# Altium schematic sheet PowerMeter_PowerSupply.SchDoc: Power Meter - Power Supply
size A4; Date: 10/02/2022; Author: SFARA, Gonzalo Agustín; CompanyName: Introducción al Diseño de Circuitos Impresos; Organization: UTN FRBA; Revision: 02; SheetNumber: 2; SheetTotal: 5
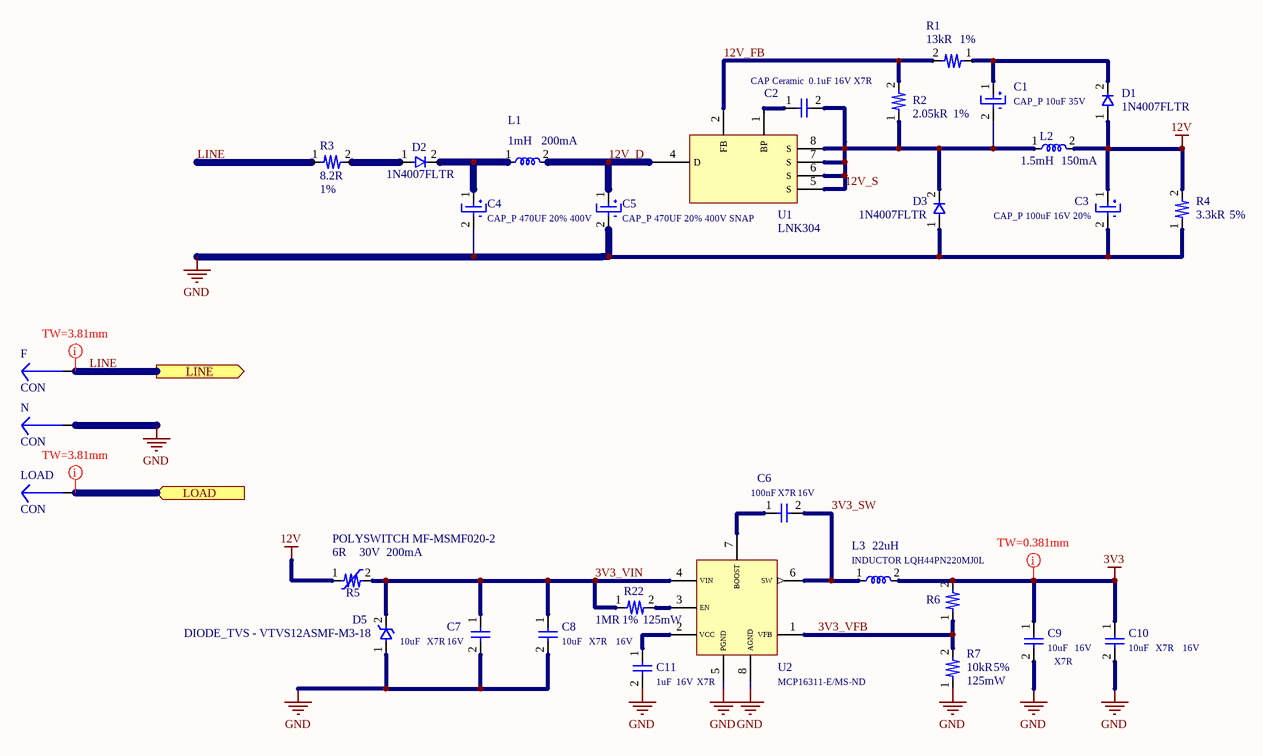
[diagram p0: PowerMeter_PowerSupply.SchDoc]

## Parts
C1  CAP_P 10uF 35V  [CAP100RP]
C2  CAP Ceramic  0.1uF 16V X7R  [C_0805]
C3  CAP_P 100uF 16V 20%  [CAP100RP]
C4  CAP_P 470UF 20% 400V  [CAP400RP]
C5  CAP_P 470UF 20% 400V SNAP  [CAP400RP]
C6  Capacitance: 100nF  Voltage Rating (DC): 16V  Dielectric: X7R  [C_0805]  (hidden comment: CAP Ceramic  0.1uF 16V X7R)
C7  Capacitance: 10uF  Dielectric: X7R  Voltage Rating: 16V  [C_1206]  (hidden comment: CAP Ceramic  10uF 16V X7R)
C8  Capacitance: 10uF  Dielectric: X7R  Voltage Rating: 16V  [C_1206]  (hidden comment: CAP Ceramic  10uF 16V X7R)
C9  Capacitance: 10uF  Dielectric: X7R  Voltage Rating: 16V  [C_1206]  (hidden comment: CAP Ceramic 10uF 16V X7R)
C10  Capacitance: 10uF  Dielectric: X7R  Voltage Rating: 16V  [C_1206]  (hidden comment: CAP Ceramic 10uF 16V X7R)
C11  Capacitance: 1uF  Dielectric: X7R  Voltage Rating: 16V  [C_0805]  (hidden comment: CAP Ceramic  1uF 16V X7R)
D1  Manufacturer Part Number: 1N4007FLTR  [SOD_123]  (hidden comment: DIODE)
D2  Manufacturer Part Number: 1N4007FLTR  [SOD_123]  (hidden comment: Standard Rectifier 1000V SOD-123)
D3  Manufacturer Part Number: 1N4007FLTR  [SOD_123]  (hidden comment: DIODE 1N4007FLTR)
D5  DIODE_TVS - VTVS12ASMF-M3-18  [SOD_923]
F  CON  [HOLE 2.8]  (no BOM)
L1  Current Rating: 200mA  Inductance: 1mH  [LQH44]  (hidden comment: INDUCTOR RLH0912-102KL)
L2  Inductance: 1.5mH  Current Rating: 150mA  [LQH44]  (hidden comment: INDUCTOR AIUR-16-152K)
L3  INDUCTOR LQH44PN220MJ0L  Inductance: 22uH  [LQH44]
LOAD  CON  [HOLE 2.8]  (no BOM)
N  CON  [HOLE 2.8]  (no BOM)
R1  Resistance: 13kR  Tolerance: 1%  [R_0805]  (hidden comment: RES 13K Ohm 1% 1/8W)
R2  Resistance: 2.05kR  Tolerance: 1%  [R_0805]  (hidden comment: RES 2.05K Ohm 1% 1/8W)
R3  Resistance: 8.2R  Tolerance: 1%  [R_0805]  (hidden comment: RES 0805 8.2 Ohm 1W)
R4  Tolerance: 5%  Resistance: 3.3kR  [R_0805]  (hidden comment: RES  3.3 K Ohms 0.125W; +/-5%)
R5  POLYSWITCH MF-MSMF020-2  Resistance: 6R  Hold Current: 200mA  Voltage Rating (DC): 30V  [NANOSMDC]
R6  RES 31.2K Ohm 1% 1/8W  [R_0805]  (value not drawn)
R7  Resistance: 10kR  Tolerance: 5%  Power Rating: 125mW  [R_0805]  (hidden comment: RES 10K Ohm 1% 1/8W)
R22  Resistance: 1MR  Power Rating: 125mW  Tolerance: 1%  [R_0805]  (hidden comment: RES 1M Ohm 1% 1/8W)
U1  LNK304  [LNK304]
U2  Supplier Part Number 1: MCP16311-E/MS-ND  [MCP16311/2]  (hidden comment: STEP-DOWN REGULATOR MCP16311-E/MS-ND)

## Ports
LINE (out), LOAD (in)

## Nets
3V3: C9.1 C10.1 L3.2 R6.2
12V: C3.1 D1.1 L2.2 R4.2 R5.1
GND: C3.2 C4.2 C5.2 C7.2 C8.2 C9.2 C10.2 C11.2 D3.1 D5.1 N.1 R4.1 R7.1 U2.5(PGND) U2.8(AGND)
3V3_SW: C6.2 L3.1 U2.6(SW)
3V3_VFB: R6.1 R7.2 U2.1(VFB)
3V3_VIN: C7.1 C8.1 D5.2 R5.2 R22.1 U2.4(VIN)
12V_D: C5.1 L1.2 U1.4(D)
12V_FB: R1.2 R2.2 U1.2(FB)
12V_S: C1.2 C2.2 D3.2 L2.1 R2.1 U1.5(S) U1.6(S) U1.7(S) U1.8(S)
LINE: F.1 R3.1 ; port LINE
LOAD: LOAD.1 ; port LOAD
NetC1_1: C1.1 D1.2 R1.1
NetC2_1: C2.1 U1.1(BP)
NetC4_1: C4.1 D2.2 L1.1
NetC6_1: C6.1 U2.7(BOOST)
NetC11_1: C11.1 U2.2(VCC)
NetD2_1: D2.1 R3.2
NetR22_2: R22.2 U2.3(EN)

## Layout directives
rule Width Constraint [Pref Width = 150mil    Min Width = 70mil    Max Width = 180mil]: LINE, LOAD
rule Width Constraint [Pref Width = 18mil    Min Width = 15mil    Max Width = 20mil]: 3V3

## Notes on the sheet
- Title:
- Size:
- Author:
- A4
- Sheet
- of
- Revision:
- File:
- Date:

## Library data of the parts
C1 = CAP_P: Cap Aluminum 10uF 35V 20% Radial 2000 hr 85°C Ammo Pack; Manufacturer: Panasonic; Manufacturer Part Number: ECA-1VM100B; Ripple Current: 60mA; Life (Hours): 2000Hour; Lead/Base Style: Straight; Polarity: Polar; Supplier 1: Mouser; Supplier Part Number 1: 667-ECA-1VM100B; RoHS: Yes; Category: Aluminum Electrolytic Capacitors; Stock 1: 1014; Pricing 1: 1=0,24000, 10=0,16100, 50=0,16100, 100=0,08200, 500=0,05600, 1000=0,05000, 10000=0,04700 (USD); Mount: Through Hole; Case/Package: Radial; Min Operating Temperature: -40°C; Max Operating Temperature: 85°C; Capacitance: 10uF; Voltage Rating: 35V; Tolerance: 20%; Packaging: Ammo Pack; Package Quantity: 2000; Voltage Rating (DC): 35V; Termination: Radial; Series: M; Length: 11mm; Lead Pitch: 0.197inch; Height - Seated (Max): 0.472inch; RoHS Compliant: Yes; ComponentLink1URL: https://datasheet.ciiva.com/105/eca-xxmspec-105829.pdf?src-supplier=Digi-Key; ComponentLink1Description: https://datasheet.ciiva.com/105/eca-xxmspec-105829.pdf?src-supplier=Digi-Key; ComponentLink2URL: https://datasheet.ciiva.com/24035/aba0000ce12-465472-24035802.pdf?src-supplier=Mouser; ComponentLink2Description: https://datasheet.ciiva.com/24035/aba0000ce12-465472-24035802.pdf?src-supplier=Mouser
C2 = CAP_NP: Cap Ceramic 0.1uF 16V X7R 10% SMD 0805 125C Paper T/R; Manufacturer: Yageo; Manufacturer Part Number: CC0805KPX7R7BB104; Capacitance: 100nF; Supplier 1: Digi-Key; Supplier Part Number 1: 13-CC0805KPX7R7BB104TR-ND; RoHS: Yes; Category: Ceramic Capacitors; Pricing 1: 60000=0,01497 (USD); Case/Package: 0805; Case Code (Imperial): 0805; Case Code (Metric): 2012; Weight: 0.000194oz; Min Operating Temperature: -55°C; Max Operating Temperature: 125°C; Tolerance: 10%; Packaging: Tape and Reel; Voltage Rating (DC): 16V; Dielectric: X7R; Termination: SMD/SMT; Resistor Type: Ceramic; Lead Free: Lead Free; Halogen Free: Halogen Free; RoHS Compliant: Yes; ComponentLink1URL: https://datasheet.ciiva.com/13265/upy-gphc-x7r-6-3v-to-50v-8-12304-13265229.pdf?src-supplier=Mouser; ComponentLink1Description: https://datasheet.ciiva.com/13265/upy-gphc-x7r-6-3v-to-50v-8-12304-13265229.pdf?src-supplier=Mouser
C3 = CAP_P: Cap Aluminum 100uF 16V 20% (5 X 11mm) Radial 2.5mm 180mA 2000h 85°C Ammo Pack; Manufacturer: Panasonic; Manufacturer Part Number: ECA-1CM101I; Life (Hours): 2000Hour; Leakage Current: 3mA; Dissipation Factor: 0.2%; Lead/Base Style: Straight; Lead Diameter: 0.5mm; ComponentLink6URL: https://datasheet.ciiva.com/15197/getdatasheetpartid-408579-15197882.pdf?src-supplier=Verical; ComponentLink6Description: https://datasheet.ciiva.com/15197/getdatasheetpartid-408579-15197882.pdf?src-supplier=Verical; ComponentLink7URL: https://datasheet.ciiva.com/7803/1907780-7803673.pdf?src-supplier=Element14; ComponentLink7Description: https://datasheet.ciiva.com/7803/1907780-7803673.pdf?src-supplier=Element14; ComponentLink8URL: https://datasheet.ciiva.com/14604/70067785-14604665.pdf?src-supplier=Allied+Electronics; ComponentLink8Description: https://datasheet.ciiva.com/14604/70067785-14604665.pdf?src-supplier=Allied+Electronics; ComponentLink9URL: https://datasheet.ciiva.com/17530/aba0000ce12-17530237.pdf?src-supplier=Avnet+Europe; ComponentLink9Description: https://datasheet.ciiva.com/17530/aba0000ce12-17530237.pdf?src-supplier=Avnet+Europe; Supplier 1: Digi-Key; Supplier Part Number 1: P10408TB-ND; RoHS: Yes; Category: Aluminum Electrolytic Capacitors; Stock 1: 8000; Pricing 1: 2000=0,05364 (USD); Mount: Through Hole,PCB; Case/Package: Radial; Contact Plating: Tin; Min Operating Temperature: -40°C; Max Operating Temperature: 85°C; Tolerance: 20%; Capacitance: 100uF; Ripple Current: 180mA; Voltage Rating: 16V; Voltage Rating (DC): 16V; Package Quantity: 2000; Packaging: Ammo Pack; Termination: Radial; Voltage: 16V; Series: M; Construction: RADIAL; Diameter: 5mm; Length: 11mm; Height: 11mm; Lead Pitch: 2.5mm; Height - Seated (Max): 0.472inch; Radiation Hardening: No; REACH SVHC: Unknown; Lead Free: Lead Free; RoHS Compliant: Yes; ComponentLink1URL: https://datasheet.ciiva.com/6134/aba0000ce12-6134415.pdf?src-supplier=Farnell; ComponentLink1Description: https://datasheet.ciiva.com/6134/aba0000ce12-6134415.pdf?src-supplier=Farnell; ComponentLink2URL: https://datasheet.ciiva.com/24026/aba0000ce12-465472-24026826.pdf?src-supplier=Mouser; ComponentLink2Description: https://datasheet.ciiva.com/24026/aba0000ce12-465472-24026826.pdf?src-supplier=Mouser; ComponentLink3URL: https://datasheet.ciiva.com/11680/aba0000ce12-11680309.pdf?src-supplier=Avnet; ComponentLink3Description: https://datasheet.ciiva.com/11680/aba0000ce12-11680309.pdf?src-supplier=Avnet; ComponentLink4URL: https://datasheet.ciiva.com/16202/aba0000ce12-16202587.pdf?src-supplier=Future+Electronics; ComponentLink4Description: https://datasheet.ciiva.com/16202/aba0000ce12-16202587.pdf?src-supplier=Future+Electronics; ComponentLink5URL: https://datasheet.ciiva.com/15197/getdatasheetpartid-408579-15197882.pdf?src-supplier=Verical; ComponentLink5Description: https://datasheet.ciiva.com/15197/getdatasheetpartid-408579-15197882.pdf?src-supplier=Verical
C4 = CAP_P: CAP ALUM 470UF 20% 400V SNAP; Manufacturer: Rubycon; Manufacturer Part Number: 400USG470MEFC25X50; Polarity: Polar; Life (Hours): 3000Hour; Supplier 1: Digi-Key; Supplier Part Number 1: 400USG470MEFC25X50-ND; RoHS: Yes; Category: Aluminum Electrolytic Capacitors; Pricing 1: 200=2,69535 (USD); Mount: Through Hole; Case/Package: Radial; Min Operating Temperature: -25°C; Max Operating Temperature: 85°C; Packaging: Bulk; Capacitance: 470uF; Tolerance: 20%; Voltage Rating: 400V; ComponentLink1URL: http://www.rubycon.co.jp/en/catalog/e_pdfs/aluminum/e_USG.pdf?src-supplier=Digi-Key; ComponentLink1Description: http://www.rubycon.co.jp/en/catalog/e_pdfs/aluminum/e_USG.pdf?src-supplier=Digi-Key
C5 = CAP_P: CAP ALUM 470UF 20% 400V; Manufacturer: Rubycon; Manufacturer Part Number: 400USG470MEFC25X50; Polarity: Polar; Life (Hours): 3000Hour; Supplier 1: Digi-Key; Supplier Part Number 1: 400USG470MEFC25X50-ND; RoHS: Yes; Category: Aluminum Electrolytic Capacitors; Pricing 1: 200=2,69535 (USD); Mount: Through Hole; Case/Package: Radial; Min Operating Temperature: -25°C; Max Operating Temperature: 85°C; Packaging: Bulk; Capacitance: 470uF; Tolerance: 20%; Voltage Rating: 400V; ComponentLink1URL: http://www.rubycon.co.jp/en/catalog/e_pdfs/aluminum/e_USG.pdf?src-supplier=Digi-Key; ComponentLink1Description: http://www.rubycon.co.jp/en/catalog/e_pdfs/aluminum/e_USG.pdf?src-supplier=Digi-Key
C6 = CAP_NP: Cap Ceramic 0.1uF 16V X7R 10% SMD 0805 125C Paper T/R; Manufacturer: Yageo; Manufacturer Part Number: CC0805KPX7R7BB104; Supplier 1: Digi-Key; Supplier Part Number 1: 13-CC0805KPX7R7BB104TR-ND; RoHS: Yes; Category: Ceramic Capacitors; Pricing 1: 60000=0,01497 (USD); Case/Package: 0805; Case Code (Imperial): 0805; Case Code (Metric): 2012; Weight: 0.000194oz; Min Operating Temperature: -55°C; Max Operating Temperature: 125°C; Tolerance: 10%; Packaging: Tape and Reel; Termination: SMD/SMT; Resistor Type: Ceramic; Lead Free: Lead Free; Halogen Free: Halogen Free; RoHS Compliant: Yes; ComponentLink1URL: https://datasheet.ciiva.com/13265/upy-gphc-x7r-6-3v-to-50v-8-12304-13265229.pdf?src-supplier=Mouser; ComponentLink1Description: https://datasheet.ciiva.com/13265/upy-gphc-x7r-6-3v-to-50v-8-12304-13265229.pdf?src-supplier=Mouser
C7-C10 = CAP_NP: CL31 Series 1206 10 uF 16 V ±10% Tolerance X7R Multilayer Ceramic Capacitor; Manufacturer: Samsung; Manufacturer Part Number: CL31B106KOHNNNF; Supplier 1: Future Electronics; Supplier Part Number 1: 5039552; RoHS: Yes; Category: Ceramic Capacitors; Stock 1: 2000; Pricing 1: 8000=0,04240, 16000=0,03440, 24000=0,03410, 32000=0,03390 (USD); Mount: Surface Mount; Case/Package: 1206; Min Operating Temperature: -55°C; Max Operating Temperature: 125°C; Tolerance: 10%; Packaging: Tape and Reel; Package Quantity: 8000; Voltage Rating (DC): 16V; Series: CL; Construction: Flat; Length: 3.2mm; Width: 0.063inch; Height: 1.6mm; Thickness: 0.071inch; Depth: 1.6mm; Radiation Hardening: No; Lead Free: Lead Free; RoHS Compliant: Yes; ComponentLink1URL: https://datasheet.ciiva.com/25728/cl31b106kohnnnf-25728936.pdf?src-supplier=Digi-Key; ComponentLink1Description: https://datasheet.ciiva.com/25728/cl31b106kohnnnf-25728936.pdf?src-supplier=Digi-Key
  C7 C9 C10: Value: *
C11 = CAP_NP: Cap Ceramic 1uF 16V X7R 10% Pad SMD 0805 125C T/R; Manufacturer: Samsung; Manufacturer Part Number: CL21B105KOFNNNF; Supplier 1: RSComponents; Supplier Part Number 1: 7665607; RoHS: Yes; Category: Ceramic Capacitors; Stock 1: 10000; Pricing 1: 10000=0,01200, 30000=0,01200, 50000=0,01100, 100000=0,01100, 250000=0,01000, 10000=0,00900, 30000=0,00900, 50000=0,00800, 100000=0,00800, 250000=0,00700 (USD); Mount: Surface Mount; Case/Package: 0805; Material: Ceramic; Min Operating Temperature: -55°C; Max Operating Temperature: 125°C; Tolerance: 10%; Packaging: Tape and Reel; Package Quantity: 10000; Voltage: 16V; Voltage Rating (DC): 16V; Series: CL; Construction: Flat; Length: 2mm; Width: 0.049inch; Height: 1.25mm; Thickness: 0.053inch; Depth: 1.25mm; Radiation Hardening: No; Lead Free: Lead Free; ComponentLink1URL: https://datasheet.ciiva.com/15195/getdatasheetpartid-359322-15195881.pdf?src-supplier=Verical; ComponentLink1Description: https://datasheet.ciiva.com/15195/getdatasheetpartid-359322-15195881.pdf?src-supplier=Verical; ComponentLink2URL: https://datasheet.ciiva.com/29199/455923-da-01-en-vs-kondensator-0805-29199045.pdf?src-supplier=Conrad; ComponentLink2Description: https://datasheet.ciiva.com/29199/455923-da-01-en-vs-kondensator-0805-29199045.pdf?src-supplier=Conrad; ComponentLink3URL: https://datasheet.ciiva.com/16290/cl05b104kq5nnnc-16290394.pdf?src-supplier=Future+Electronics; ComponentLink3Description: https://datasheet.ciiva.com/16290/cl05b104kq5nnnc-16290394.pdf?src-supplier=Future+Electronics; ComponentLink4URL: https://datasheet.ciiva.com/26310/mlcc-catalogdownload2013-eng-26310168.pdf?src-supplier=Distrelec; ComponentLink4Description: https://datasheet.ciiva.com/26310/mlcc-catalogdownload2013-eng-26310168.pdf?src-supplier=Distrelec
D1 D3 = DIODE: Standard Rectifier 1000V SOD-123; Manufacturer: Sangdest Microelectronics; Supplier 1: Digi-Key; Supplier Part Number 1: 1655-1N4007FLCT-ND; RoHS: No; Stock 1: 1344; Pricing 1: 1=0,15000, 10=0,13400, 100=0,07310, 500=0,04502, 1000=0,03069 (USD)
D2 = DIODE: Manufacturer: Sangdest Microelectronics; Supplier 1: Digi-Key; Supplier Part Number 1: 1655-1N4007FLCT-ND; RoHS: No; Description: Standard Rectifier 1000V SOD-123; Stock 1: 1934; Pricing 1: 1=0,15000, 10=0,13400, 100=0,07310, 500=0,04502, 1000=0,03069 (USD)
D5 = DIODE_TVS: Esd Protection Diode Smf Do219Ab5%; 12.4V; ir0.05 A; ip19.5A; p400W; cd807Pf; Manufacturer: Vishay; Supplier 1: Digi-Key; Supplier Part Number 1: VTVS12ASMF-M3-18-ND; Manufacturer Part Number: VTVS12ASMF-M3-18; RoHS: Yes; Category: TVS Diodes; Pricing 1: 50000=0,10890 (USD); RoHS Compliant: Yes
F LOAD N = CON: Hole
L1 = INDUCTOR: Magnetics - Fixed Inductor Through Hole / Bulk, Bag Packaging Rohs Compliant: Yes; Manufacturer: Bourns; Core Material: Ferrite; Self Resonant Frequency: 1.9MHz; Tolerance: 10%; Shielding: Unshielded; DC Resistance (DCR): 4.3R; Test Frequency: 1kHz; Max DC Current: 510mA; Q Factor: 20; Supplier 1: Mouser; Supplier Part Number 1: 652-RLH0912-102KL; Manufacturer Part Number: RLH0912-102KL; RoHS: Yes; Category: Fixed Inductors; Stock 1: 664; Pricing 1: 1=0,67000, 10=0,49900, 50=0,49900, 100=0,41900, 1000=0,28400, 10000=0,25900 (USD); Mount: Through Hole; Case/Package: Radial; Min Operating Temperature: -40°C; Max Operating Temperature: 105°C; Package Quantity: 1000; Packaging: Bulk; Resistor Type: Wirewound; Termination: Radial; Series: RLB; Height - Seated (Max): 0.512inch; ComponentLink1URL: http://www.mouser.com/ds/2/54/lb9012-778371.pdf?src-supplier=Mouser; ComponentLink1Description: http://www.mouser.com/ds/2/54/lb9012-778371.pdf?src-supplier=Mouser; ComponentLink2URL: http://www.bourns.com/docs/Product-Datasheets/rlb.pdf?src-supplier=Digi-Key; ComponentLink2Description: http://www.bourns.com/docs/Product-Datasheets/rlb.pdf?src-supplier=Digi-Key
L2 = INDUCTOR: Inductor Power Unshielded Drum Core 1500uH 10% 10KHz Ferrite 0.15A 3.5Ohm DCR RDL Box; Manufacturer: Abracon; Saturation Current: 135mA; DC Resistance (DCR): 3.5R; Supplier 1: Digi-Key; Supplier Part Number 1: AIUR-16-152K-ND; Manufacturer Part Number: AIUR-16-152K; RoHS: Yes; Category: Fixed Inductors; Stock 1: 1719; Pricing 1: 1=0,75000, 10=0,65500, 25=0,60840, 50=0,51480, 100=0,46800, 250=0,43992, 500=0,39312, 1000=0,31824, 2500=0,29952 (USD); Mount: Through Hole; Case/Package: Radial; Core Material: Ferrite; Min Operating Temperature: -25°C; Max Operating Temperature: 85°C; Packaging: Bulk; Resistor Type: Wirewound; Shielding: Unshielded; Test Frequency: 10kHz; Tolerance: 10%; Height - Seated (Max): 0.374inch; ComponentLink1URL: http://www.abracon.com/Magnetics/radial/AIUR15-16.pdf?src-supplier=Digi-Key; ComponentLink1Description: http://www.abracon.com/Magnetics/radial/AIUR15-16.pdf?src-supplier=Digi-Key
L3 = INDUCTOR: Inductor Power Chip Shielded Wirewound 22uH 20% 100KHz Ferrite 0.55A 0.576Ohm DCR 1515 T/R; Manufacturer: Murata; Self Resonant Frequency: 18MHz; Shielding: Unshielded; Current Rating: 550mA; DC Resistance (DCR): 576mR; Saturation Current: 400mA; Supplier 1: Digi-Key; Supplier Part Number 1: 490-7775-1-ND; Manufacturer Part Number: LQH44PN220MJ0L; RoHS: Yes; Category: Fixed Inductors; Stock 1: 1622; Pricing 1: 1=0,47000, 10=0,41400, 25=0,36280, 50=0,31080, 100=0,28500, 250=0,25904, 500=0,24350 (USD); Mount: Surface Mount; Case/Package: 1515; Core Material: Ferrite; Weight: 0.002469oz; Min Operating Temperature: -40°C; Max Operating Temperature: 125°C; Tolerance: 20%; Packaging: Tape and Reel; Inductance Tolerance: 20%; Package Quantity: 1000; Max DC Current: 550mA; Termination: SMD/SMT; Resistor Type: Wirewound; Test Frequency: 100kHz; DC Current: 550mA; Series: LQH44P; Length: 4mm; Width: 4mm; Height: 0.9mm; Height - Seated (Max): 0.047inch; Depth: 4.2mm; REACH SVHC: No SVHC; Military Standard: Not; Lead Free: Lead Free; RoHS Compliant: Yes; ComponentLink1URL: https://datasheet.ciiva.com/8506/l0075s0103lqh44p-j0-8506832.pdf?src-supplier=Avnet; ComponentLink1Description: https://datasheet.ciiva.com/8506/l0075s0103lqh44p-j0-8506832.pdf?src-supplier=Avnet; ComponentLink2URL: https://datasheet.ciiva.com/3867/250lqh44pn220mj023-3867187.pdf?src-supplier=Arrow+Electronics; ComponentLink2Description: https://datasheet.ciiva.com/3867/250lqh44pn220mj023-3867187.pdf?src-supplier=Arrow+Electronics; ComponentLink3URL: https://datasheet.ciiva.com/30489/0900766b81256153-30489173.pdf?src-supplier=RSComponents; ComponentLink3Description: https://datasheet.ciiva.com/30489/0900766b81256153-30489173.pdf?src-supplier=RSComponents; ComponentLink4URL: https://datasheet.ciiva.com/29696/product-29696602.pdf?src-supplier=Digi-Key; ComponentLink4Description: https://datasheet.ciiva.com/29696/product-29696602.pdf?src-supplier=Digi-Key; ComponentLink5URL: https://datasheet.ciiva.com/29696/product-29696603.pdf?src-supplier=Digi-Key; ComponentLink5Description: https://datasheet.ciiva.com/29696/product-29696603.pdf?src-supplier=Digi-Key; ComponentLink6URL: https://datasheet.ciiva.com/29696/product-29696604.pdf?src-supplier=Digi-Key; ComponentLink6Description: https://datasheet.ciiva.com/29696/product-29696604.pdf?src-supplier=Digi-Key
R1 = RES: Res Thick Film 0805 13K Ohm 1% 1/8W ±100ppm/°C Molded SMD SMD Paper T/R; Manufacturer: Stackpole Electronics; Manufacturer Part Number: RMCF0805FG13K0; Max Power Dissipation: 125mW; Supplier 1: Digi-Key; Supplier Part Number 1: RMCF0805FG13K0-ND; RoHS: Yes; Category: Chip SMD Resistors; Pricing 1: 10000=0,00304 (USD); Mount: Surface Mount; Case/Package: 0805; Contact Plating: Tin,Matte; Min Operating Temperature: -55°C; Max Operating Temperature: 155°C; Packaging: Tape and Reel; Resistor Type: Thick Film; Number of Terminations: 2; Temperature Coefficient: 100ppm/°C; Features: Automotive AEC-Q200; Series: RMCF; Length: 0.079inch; Width: 0.049inch; Height: 0.026inch; Radiation Hardening: No; RoHS Compliant: Yes; ComponentLink1URL: https://www.seielect.com/Catalog/SEI-RMCF_RMCP.pdf?src-supplier=Digi-Key; ComponentLink1Description: https://www.seielect.com/Catalog/SEI-RMCF_RMCP.pdf?src-supplier=Digi-Key; ComponentLink2URL: https://www.seielect.com/catalog/SEI-RMCF_RMCP.pdf?src-supplier=Avnet; ComponentLink2Description: https://www.seielect.com/catalog/SEI-RMCF_RMCP.pdf?src-supplier=Avnet
R2 = RES: Res Thick Film 0805 2.05K Ohm 1% 1/8W ±200ppm/°C Molded SMD SMD Paper T/R; Manufacturer: Stackpole Electronics; Manufacturer Part Number: RMCF0805FG2K05; Temperature Coefficient: 100ppm/°C; Max Power Dissipation: 125mW; Supplier 1: Digi-Key; Supplier Part Number 1: RMCF0805FG2K05-ND; RoHS: Yes; Category: Chip SMD Resistors; Pricing 1: 10000=0,00304 (USD); Mount: Surface Mount; Case/Package: 0805; Min Operating Temperature: -55°C; Max Operating Temperature: 155°C; Packaging: Tape and Reel; Resistor Type: Thick Film; Features: Automotive AEC-Q200; Series: RMCF; Number of Terminations: 2; Radiation Hardening: No; ComponentLink1URL: https://www.seielect.com/catalog/SEI-RMCF_RMCP.pdf?src-supplier=Avnet; ComponentLink1Description: https://www.seielect.com/catalog/SEI-RMCF_RMCP.pdf?src-supplier=Avnet; ComponentLink2URL: https://www.seielect.com/catalog/sei-rmcf_rmcp.pdf?src-supplier=Digi-Key; ComponentLink2Description: https://www.seielect.com/catalog/sei-rmcf_rmcp.pdf?src-supplier=Digi-Key
R3 = RES: Res Thin Film 0805 8.2 Ohm 1% 1W ±100ppm/C Pad SMD T/R; Manufacturer: Vishay Dale Thin Film; Manufacturer Part Number: PCAN0805K8R20FST5; Temperature Coefficient: 100ppm/°C; Supplier 1: Digi-Key; Supplier Part Number 1: 764-1235-1-ND; RoHS: Yes; Category: Chip SMD Resistors; Stock 1: 80; Pricing 1: 1=1,36000, 10=1,20400, 100=0,87410 (USD); Case/Package: 0805; Case Code (Metric): 2012; Case Code (Imperial): 0805; Min Operating Temperature: -55°C; Max Operating Temperature: 155°C; Packaging: Tape and Reel; Resistor Type: Thin Film; Number of Terminations: 2; Max Power Dissipation: 1W; Features: Moisture Resistant; Length: 0.08inch; Width: 0.05inch; Height: 0.018inch; RoHS Compliant: Yes; ComponentLink1URL: http://www.vishay.com/docs/60125/pcan.pdf?src-supplier=Digi-Key; ComponentLink1Description: http://www.vishay.com/docs/60125/pcan.pdf?src-supplier=Digi-Key; ComponentLink2URL: http://www.vishay.com/docs/49563/_pcan_vmn-pt0416.pdf?src-supplier=Digi-Key; ComponentLink2Description: http://www.vishay.com/docs/49563/_pcan_vmn-pt0416.pdf?src-supplier=Digi-Key
R4 = RES: Resistor, Thick Film Chip; 3.3 K Ohms; Case 0805; 0.125W; +/-5%; SMD; 200ppm/K; 150V; Manufacturer: Vishay Dale; Manufacturer Part Number: CRCW08053K30JNTA; Temperature Coefficient: 200ppm/°C; Power Rating: 125mW; Supplier 1: Arrow Electronics; Supplier Part Number 1: CRCW08053K30JNTA; RoHS: No; Category: Chip SMD Resistors; Stock 1: 827; Pricing 1: 1=0,11090, 10=0,09470, 25=0,09380, 100=0,04100, 250=0,03880, 500=0,03830 (USD); Case/Package: 0805; Case Code (Metric): 2012; Case Code (Imperial): 0805; Contact Plating: Tin,Lead; Weight: 0.000194oz; Min Operating Temperature: -55°C; Max Operating Temperature: 155°C; Packaging: Tape and Reel; Resistor Type: Thick Film; Series: CRCW; Construction: Rectangular; Number of Terminations: 2; Max Power Dissipation: 125mW; Voltage Rating (DC): 150V; Features: Automotive AEC-Q200; Voltage Rating: 150V; Package Quantity: 5000; Power Dissipation: 125mW; Length: 2mm; Width: 0.049inch; Height: 0.02inch; Depth: 1.25mm; Radiation Hardening: No; Military Standard: Not; Lead Free: Contains Lead; RoHS Compliant: No; ComponentLink1URL: https://datasheet.ciiva.com/2565/dcrcw-2565787.pdf?src-supplier=Digi-Key; ComponentLink1Description: https://datasheet.ciiva.com/2565/dcrcw-2565787.pdf?src-supplier=Digi-Key; ComponentLink2URL: https://datasheet.ciiva.com/9080/dcrcw-9080603.pdf?src-supplier=Avnet; ComponentLink2Description: https://datasheet.ciiva.com/9080/dcrcw-9080603.pdf?src-supplier=Avnet; ComponentLink3URL: https://datasheet.ciiva.com/15159/getdatasheetpartid-79319-15159830.pdf?src-supplier=Verical; ComponentLink3Description: https://datasheet.ciiva.com/15159/getdatasheetpartid-79319-15159830.pdf?src-supplier=Verical
R5 = POLYSWITCH: PTC Resettable Fuse 0.2A(hold) 0.4A(trip) 30V 80A 0.8W 0.06s 0.4Ohm SMD Solder Pad 1812 T/R Automotive; Manufacturer: Bourns; Number of Terminals/Pins: 2; Power Dissipation: 800mW; Tolerance: 5%; Trip Current: 400mA; Aging: 1000 hr @ +85 °C (Passive); Approvals: UL,CSA,TUV; Supplier 1: RSComponents; Supplier Part Number 1: 6478140; Manufacturer Part Number: MF-MSMF020-2; RoHS: Yes; Category: Fuses; Stock 1: 3280; Pricing 1: 10=0,31300, 100=0,30500, 500=0,29600, 1500=0,28800, 2500=0,28100, 10=0,22600, 100=0,22000, 500=0,21400, 1500=0,20800, 2500=0,20300 (USD); Mount: Surface Mount,PCB; Case/Package: 1812; Number of Pins: 2; Case Code (Metric): 4532; Case Code (Imperial): 1812; Contact Plating: Gold; Terminal Material: Gold; Min Operating Temperature: -40°C; Max Operating Temperature: 85°C; Package Quantity: 1; Packaging: Tape and Reel; Series: MF-MSMF; Operating Supply Voltage: 30V; Max Current Rating: 80A; Current Rating: 80A; Voltage Rating: 30V; Termination: SMD/SMT; Time to Trip: 0.06s; Length: 4.73mm; Width: 3.41mm; Height: 1.1mm; Radiation Hardening: No; REACH SVHC: No SVHC; Lead Free: Lead Free; RoHS Compliant: Yes; ComponentLink1URL: https://datasheet.ciiva.com/326/mfmsmf-326400.pdf?src-supplier=Farnell; ComponentLink1Description: https://datasheet.ciiva.com/326/mfmsmf-326400.pdf?src-supplier=Farnell; ComponentLink2URL: https://datasheet.ciiva.com/326/mfmsmf-326400.pdf?src-supplier=Avnet; ComponentLink2Description: https://datasheet.ciiva.com/326/mfmsmf-326400.pdf?src-supplier=Avnet; ComponentLink3URL: https://datasheet.ciiva.com/34302/1164171-34302040.pdf?src-supplier=Jameco; ComponentLink3Description: https://datasheet.ciiva.com/34302/1164171-34302040.pdf?src-supplier=Jameco; ComponentLink4URL: https://datasheet.ciiva.com/1228/1695373-1228112.pdf?src-supplier=Newark; ComponentLink4Description: https://datasheet.ciiva.com/1228/1695373-1228112.pdf?src-supplier=Newark; ComponentLink5URL: https://datasheet.ciiva.com/14539/70153434-14539497.pdf?src-supplier=Allied+Electronics; ComponentLink5Description: https://datasheet.ciiva.com/14539/70153434-14539497.pdf?src-supplier=Allied+Electronics; ComponentLink6URL: https://datasheet.ciiva.com/1274/1786007-1274494.pdf?src-supplier=Element14; ComponentLink6Description: https://datasheet.ciiva.com/1274/1786007-1274494.pdf?src-supplier=Element14; ComponentLink7URL: https://datasheet.ciiva.com/1274/1786007-1274493.pdf?src-supplier=Element14; ComponentLink7Description: https://datasheet.ciiva.com/1274/1786007-1274493.pdf?src-supplier=Element14; ComponentLink8URL: https://datasheet.ciiva.com/15187/getdatasheetpartid-90851-15187031.pdf?src-supplier=Verical; ComponentLink8Description: https://datasheet.ciiva.com/15187/getdatasheetpartid-90851-15187031.pdf?src-supplier=Verical; ComponentLink9URL: https://datasheet.ciiva.com/25894/mfmsmf-25894167.pdf?src-supplier=Avnet+Europe; ComponentLink9Description: https://datasheet.ciiva.com/25894/mfmsmf-25894167.pdf?src-supplier=Avnet+Europe; ComponentLink10URL: https://datasheet.ciiva.com/3019/mfmsmf-3019618.pdf?src-supplier=Avnet; ComponentLink10Description: https://datasheet.ciiva.com/3019/mfmsmf-3019618.pdf?src-supplier=Avnet; ComponentLink11URL: https://datasheet.ciiva.com/326/mfmsmf-326528.pdf?src-supplier=Digi-Key; ComponentLink11Description: https://datasheet.ciiva.com/326/mfmsmf-326528.pdf?src-supplier=Digi-Key; ComponentLink12URL: https://datasheet.ciiva.com/326/mfmsmf-326529.pdf?src-supplier=Digi-Key; ComponentLink12Description: https://datasheet.ciiva.com/326/mfmsmf-326529.pdf?src-supplier=Digi-Key; ComponentLink13URL: https://datasheet.ciiva.com/326/mfmsmf-326527.pdf?src-supplier=Digi-Key; ComponentLink13Description: https://datasheet.ciiva.com/326/mfmsmf-326527.pdf?src-supplier=Digi-Key; ComponentLink14URL: https://datasheet.ciiva.com/30062/575mfmsmf-30062439.pdf?src-supplier=Onlinecomponents.com; ComponentLink14Description: https://datasheet.ciiva.com/30062/575mfmsmf-30062439.pdf?src-supplier=Onlinecomponents.com; ComponentLink15URL: https://datasheet.ciiva.com/48700/001055634-da-01-en-sich-ptc-reset-mf-msmf020-2-0-2a-30v-48700188.pdf?src-supplier=Conrad; ComponentLink15Description: https://datasheet.ciiva.com/48700/001055634-da-01-en-sich-ptc-reset-mf-msmf020-2-0-2a-30v-48700188.pdf?src-supplier=Conrad
R6 = RES: Res 31.2K Ohm 1% 1/8W 0805; Manufacturer: KOA Speer; Manufacturer Part Number: RN73R2ATTD3122F100; Supplier 1: Digi-Key; Supplier Part Number 1: 2019-RN73R2ATTD3122F100CT-ND; RoHS: Yes; Category: Chip SMD Resistors; Pricing 1: 1000=0,06962 (USD)
R7 = RES: Res Thick Film 0805 10K Ohm 5% 1/8W ±200ppm/°C Molded SMD SMD Paper T/R; Manufacturer: Vishay Dale; Manufacturer Part Number: CRCW080510K0JNEB; Voltage Rating: 150V; Supplier 1: Future Electronics; Supplier Part Number 1: 2941144; RoHS: Yes; Category: Chip SMD Resistors; Stock 1: 20000; Pricing 1: 10000=0,02140, 20000=0,01740, 30000=0,01730, 40000=0,01720, 50000=0,01710 (USD); Case/Package: 0805; Weight: 0.000194oz; Case Code (Imperial): 0805; Case Code (Metric): 2012; Contact Plating: Tin; Min Operating Temperature: -55°C; Max Operating Temperature: 155°C; Packaging: Tape and Reel; Package Quantity: 10000; Resistor Type: Thick Film; Termination: SMD/SMT; Number of Terminations: 2; Max Power Dissipation: 125mW; Temperature Coefficient: 200ppm/°C; Voltage Rating (DC): 150V; Working Voltage: 150V; Features: Automotive AEC-Q200; Series: CRCW; Construction: Rectangular; Technology: THICK FILM; Resistance Tolerance: 5%; Length: 2mm; Width: 1.25mm; Height: 0.02inch; Depth: 1.25mm; Radiation Hardening: No; REACH SVHC: Unknown; Military Standard: Not; Lead Free: Lead Free; ComponentLink1URL: https://datasheet.ciiva.com/3258/dcrcwe3-3258030.pdf?src-supplier=Avnet; ComponentLink1Description: https://datasheet.ciiva.com/3258/dcrcwe3-3258030.pdf?src-supplier=Avnet; ComponentLink2URL: https://datasheet.ciiva.com/16199/dcrcwe3-16199191.pdf?src-supplier=Future+Electronics; ComponentLink2Description: https://datasheet.ciiva.com/16199/dcrcwe3-16199191.pdf?src-supplier=Future+Electronics; ComponentLink3URL: https://datasheet.ciiva.com/7725/dcrcwe3-7725772.pdf?src-supplier=Element14; ComponentLink3Description: https://datasheet.ciiva.com/7725/dcrcwe3-7725772.pdf?src-supplier=Element14
R22 = RES: Res Thick Film 0805 1M Ohm 1% 1/8W ±200ppm/°C Molded SMD Paper T/R; Manufacturer: Yageo; Manufacturer Part Number: RV0805FR-071ML; Voltage Rating: 400V; Supplier 1: Digi-Key; Supplier Part Number 1: 311-1MNGCT-ND; RoHS: Yes; Category: Chip SMD Resistors; Stock 1: 9332; Pricing 1: 1=0,53000, 10=0,38100, 100=0,15240, 1000=0,07511, 2500=0,06959 (USD); Case/Package: 0805; Case Code (Metric): 2012; Case Code (Imperial): 0805; Min Operating Temperature: -55°C; Max Operating Temperature: 155°C; Packaging: Tape and Reel; Resistor Type: Thick Film; Number of Terminations: 2; Termination: SMD/SMT; Max Power Dissipation: 125mW; Temperature Coefficient: 200ppm/°C; Features: Moisture Resistant; Series: RV; Package Quantity: 1; Length: 0.079inch; Width: 0.049inch; Height: 0.024inch; RoHS Compliant: Yes; Lead Free: Lead Free; ComponentLink1URL: https://datasheet.ciiva.com/5558/pyu-rv-51-rohs-l-2-5558239.pdf?src-supplier=Mouser; ComponentLink1Description: https://datasheet.ciiva.com/5558/pyu-rv-51-rohs-l-2-5558239.pdf?src-supplier=Mouser
U1 = LNK304: AC to DC Switching Converter Buck 70kHz T/R 7-Pin SO-C; Manufacturer: Power Integrations; Manufacturer Part Number: LNK304DN-TL; Max Supply Voltage (AC): 265V; Min Supply Voltage (AC): 85V; Output Voltage: 12V; Nominal Supply Current: 260uA; Output Current: 120mA; Max Duty Cycle: 72%; Switching Frequency: 66kHz; Number of Outputs: 1; Max Power Dissipation: 12mW; Breakdown Voltage: 700V; Rule: UNIONINDEX=0|RULEKIND=Width|NETSCOPE=AnyNet|LAYERKIND=SameLayer|NAME=Schematic Width Constraint|MAXLIMIT=18mil|MINLIMIT=15mil|PREFEREDWIDTH=15mil|UNIT=Imperial; Supplier 1: Digi-Key; Supplier Part Number 1: 596-1129-1-ND; RoHS: Yes; Category: Voltage Regulators - Switching; Stock 1: 1155; Pricing 1: 1=1,47000, 10=1,31300, 25=1,24640, 100=1,02400, 250=0,95720, 500=0,84588, 1000=0,66780 (USD); Case/Package: SOIC; Number of Pins: 7; Min Operating Temperature: -40°C; Max Operating Temperature: 150°C; Packaging: Tape and Reel; Package Quantity: 1; Series: LinkSwitch®-TN; Supply Current: 260uA; Radiation Hardening: No; Lead Free: Lead Free; RoHS Compliant: Yes; ComponentLink1URL: https://datasheet.ciiva.com/3242/lnk302-304-306-3242895.pdf?src-supplier=Avnet; ComponentLink1Description: https://datasheet.ciiva.com/3242/lnk302-304-306-3242895.pdf?src-supplier=Avnet; ComponentLink2URL: https://datasheet.ciiva.com/25914/lnk302-304-306-25914985.pdf?src-supplier=Avnet+Europe; ComponentLink2Description: https://datasheet.ciiva.com/25914/lnk302-304-306-25914985.pdf?src-supplier=Avnet+Europe; ComponentLink3URL: https://datasheet.ciiva.com/1930/lnk302-304-306-1930578.pdf?src-supplier=Digi-Key; ComponentLink3Description: https://datasheet.ciiva.com/1930/lnk302-304-306-1930578.pdf?src-supplier=Digi-Key; ComponentLink4URL: https://datasheet.ciiva.com/1930/lnk302-304-306-1930577.pdf?src-supplier=Digi-Key; ComponentLink4Description: https://datasheet.ciiva.com/1930/lnk302-304-306-1930577.pdf?src-supplier=Digi-Key; ComponentLink5URL: https://datasheet.ciiva.com/1930/lnk302-304-306-1930579.pdf?src-supplier=Digi-Key; ComponentLink5Description: https://datasheet.ciiva.com/1930/lnk302-304-306-1930579.pdf?src-supplier=Digi-Key
U2 = MCP16311/2: Regulador switching step-down; Rule: UNIONINDEX=0|RULEKIND=Width|NETSCOPE=AnyNet|LAYERKIND=SameLayer|NAME=Schematic Width Constraint|MAXLIMIT=18mil|MINLIMIT=15mil|PREFEREDWIDTH=15mil|UNIT=Imperial; Supplier 1: Digi-Key